# Altium schematic sheet POWER_EXT_DISCRETE.SchDoc
size 594 x 420 mm; SheetNumber: 15; SheetTotal: 25
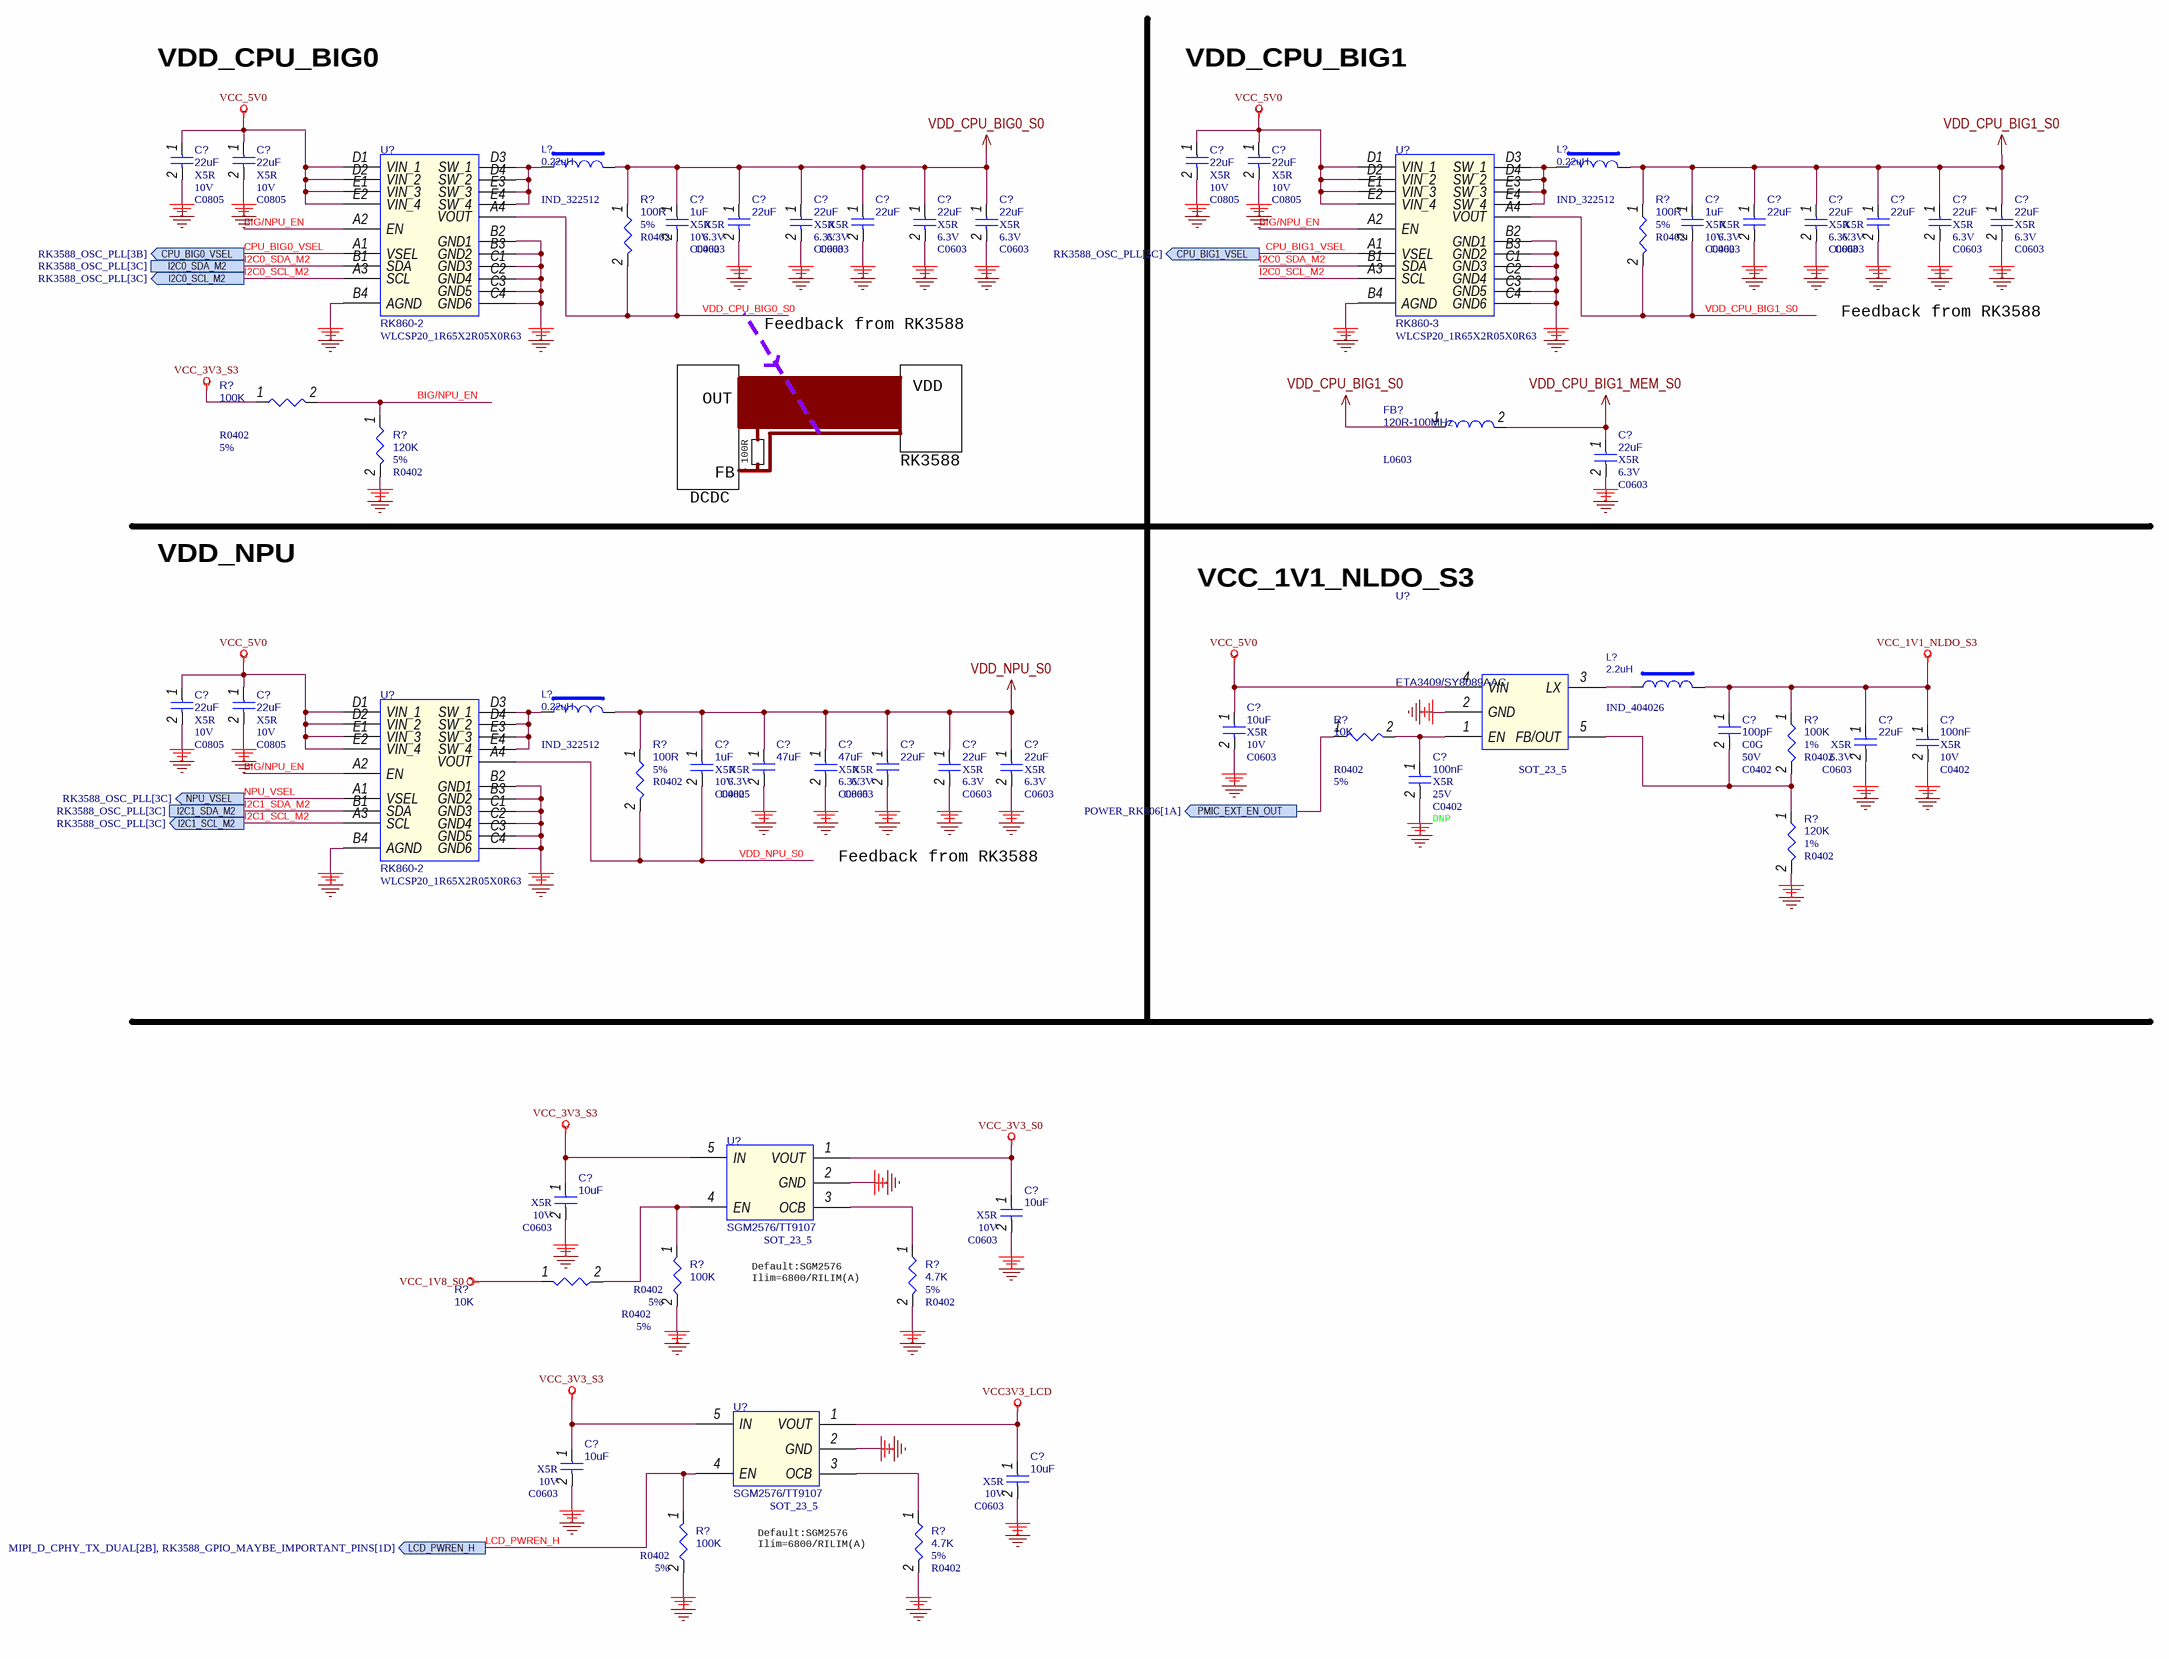
[diagram p0: POWER_EXT_DISCRETE.SchDoc]

## Parts
(Parts that share a designator on the sheet are numbered #1, #2 ... from top to bottom, then left to right.)
C?#1  22uF  Dielectric: X5R  Voltage: 10V  [C0805]
C?#2  22uF  Dielectric: X5R  Voltage: 10V  [C0805]
C?#3  22uF  Dielectric: X5R  Voltage: 10V  [C0805]
C?#4  22uF  Dielectric: X5R  Voltage: 10V  [C0805]
C?#5  1uF  Dielectric: X5R  Voltage: 10V  [C0402]
C?#6  22uF  Dielectric: X5R  Voltage: 6.3V  [C0603]
C?#7  22uF  Dielectric: X5R  Voltage: 6.3V  [C0603]
C?#8  22uF  Dielectric: X5R  Voltage: 6.3V  [C0603]
C?#9  22uF  Dielectric: X5R  Voltage: 6.3V  [C0603]
C?#10  22uF  Dielectric: X5R  Voltage: 6.3V  [C0603]
C?#11  1uF  Dielectric: X5R  Voltage: 10V  [C0402]
C?#12  22uF  Dielectric: X5R  Voltage: 6.3V  [C0603]
C?#13  22uF  Dielectric: X5R  Voltage: 6.3V  [C0603]
C?#14  22uF  Dielectric: X5R  Voltage: 6.3V  [C0603]
C?#15  22uF  Dielectric: X5R  Voltage: 6.3V  [C0603]
C?#16  22uF  Dielectric: X5R  Voltage: 6.3V  [C0603]
C?#17  22uF  Dielectric: X5R  Voltage: 6.3V  [C0603]
C?#18  22uF  Dielectric: X5R  Voltage: 10V  [C0805]
C?#19  22uF  Dielectric: X5R  Voltage: 10V  [C0805]
C?#20  10uF  Dielectric: X5R  Voltage: 10V  [C0603]
C?#21  100pF  Dielectric: C0G  Voltage: 50V  [C0402]
C?#22  22uF  Dielectric: X5R  Voltage: 6.3V  [C0603]
C?#23  100nF  Dielectric: X5R  Voltage: 10V  [C0402]
C?#24  1uF  Dielectric: X5R  Voltage: 10V  [C0402]
C?#25  47uF  Dielectric: X5R  Voltage: 6.3V  [C0805]
C?#26  47uF  Dielectric: X5R  Voltage: 6.3V  [C0805]
C?#27  22uF  Dielectric: X5R  Voltage: 6.3V  [C0603]
C?#28  22uF  Dielectric: X5R  Voltage: 6.3V  [C0603]
C?#29  22uF  Dielectric: X5R  Voltage: 6.3V  [C0603]
C?#30  100nF  Dielectric: X5R  Voltage: 25V  Option: DNP  [C0402]
C?#31  10uF  Dielectric: X5R  Voltage: 10V  [C0603]
C?#32  10uF  Dielectric: X5R  Voltage: 10V  [C0603]
C?#33  10uF  Dielectric: X5R  Voltage: 10V  [C0603]
C?#34  10uF  Dielectric: X5R  Voltage: 10V  [C0603]
FB?  120R-100MHz  [L0603]
L?#1  0.22uH  [IND_322512]
L?#2  0.22uH  [IND_322512]
L?#3  2.2uH  [IND_404026]
L?#4  0.22uH  [IND_322512]
R?#1  100R  Tolerance: 5%  [R0402]
R?#2  100R  Tolerance: 5%  [R0402]
R?#3  100K  Tolerance: 5%  [R0402]
R?#4  120K  Tolerance: 5%  [R0402]
R?#5  100K  Tolerance: 1%  [R0402]
R?#6  10K  Tolerance: 5%  [R0402]
R?#7  100R  Tolerance: 5%  [R0402]
R?#8  120K  Tolerance: 1%  [R0402]
R?#9  100K  Tolerance: 5%  [R0402]
R?#10  4.7K  Tolerance: 5%  [R0402]
R?#11  10K  Tolerance: 5%  [R0402]
R?#12  100K  Tolerance: 5%  [R0402]
R?#13  4.7K  Tolerance: 5%  [R0402]
U?#1  RK860-2  PCB Footprint: WLCSP20_1R65X2R05X0R63  [WLCSP-20]
U?#2  RK860-3  PCB Footprint: WLCSP20_1R65X2R05X0R63  [WLCSP-20]
U?#3  RK860-2  PCB Footprint: WLCSP20_1R65X2R05X0R63  [WLCSP-20]
U?#4  ETA3409/SY8089AAC  [SOT_23_5]
U?#5  SGM2576/TT9107  [SOT_23_5]
U?#6  SGM2576/TT9107  [SOT_23_5]

## Ports
CPU_BIG0_VSEL (out, see RK3588_OSC_PLL[3B]), CPU_BIG1_VSEL (out, see RK3588_OSC_PLL[3C]), I2C0_SCL_M2 (out, see RK3588_OSC_PLL[3C]), I2C0_SDA_M2 (see RK3588_OSC_PLL[3C]), I2C1_SCL_M2 (out, see RK3588_OSC_PLL[3C]), I2C1_SDA_M2 (see RK3588_OSC_PLL[3C]), LCD_PWREN_H (out, see MIPI_D_CPHY_TX_DUAL[2B], RK3588_GPIO_MAYBE_IMPORTANT_PINS[1D]), NPU_VSEL (out, see RK3588_OSC_PLL[3C]), PMIC_EXT_EN_OUT (out, see POWER_RK806[1A])

## Nets
GND: C?#1.2 C?#2.2 C?#3.2 C?#4.2 C?#6.2 C?#7.2 C?#8.2 C?#9.2 C?#10.2 C?#12.2 C?#13.2 C?#14.2 C?#15.2 C?#16.2 C?#17.2 C?#18.2 C?#19.2 C?#20.2 C?#22.2 C?#23.2 C?#25.2 C?#26.2 C?#27.2 C?#28.2 C?#29.2 C?#30.2 C?#31.2 C?#32.2 C?#33.2 C?#34.2 R?#4.2 R?#8.2 R?#9.2 R?#10.2 R?#12.2 R?#13.2 U?#1.B2(GND1) U?#1.B3(GND2) U?#1.B4(AGND) U?#1.C1(GND3) U?#1.C2(GND4) U?#1.C3(GND5) U?#1.C4(GND6) U?#2.B2(GND1) U?#2.B3(GND2) U?#2.B4(AGND) U?#2.C1(GND3) U?#2.C2(GND4) U?#2.C3(GND5) U?#2.C4(GND6) U?#3.B2(GND1) U?#3.B3(GND2) U?#3.B4(AGND) U?#3.C1(GND3) U?#3.C2(GND4) U?#3.C3(GND5) U?#3.C4(GND6) U?#4.2(GND) U?#5.2(GND) U?#6.2(GND)
VCC3V3_LCD: C?#34.1 U?#6.1(VOUT)
VCC_1V1_NLDO_S3: C?#21.1 C?#22.1 C?#23.1 L?#3.2 R?#5.1
VCC_1V8_S0: R?#11.1
VCC_3V3_S0: C?#32.1 U?#5.1(VOUT)
VCC_3V3_S3: C?#31.1 C?#33.1 R?#3.1 U?#5.5(IN) U?#6.5(IN)
VCC_5V0: C?#1.1 C?#2.1 C?#3.1 C?#4.1 C?#18.1 C?#19.1 C?#20.1 U?#1.D1(VIN_1) U?#1.D2(VIN_2) U?#1.E1(VIN_3) U?#1.E2(VIN_4) U?#2.D1(VIN_1) U?#2.D2(VIN_2) U?#2.E1(VIN_3) U?#2.E2(VIN_4) U?#3.D1(VIN_1) U?#3.D2(VIN_2) U?#3.E1(VIN_3) U?#3.E2(VIN_4) U?#4.4(VIN)
VDD_CPU_BIG0_S0: C?#5.1 C?#5.2 C?#6.1 C?#7.1 C?#8.1 C?#9.1 C?#10.1 L?#1.2 R?#1.1 R?#1.2 U?#1.A4(VOUT)
VDD_CPU_BIG1_MEM_S0: C?#17.1 FB?.2
VDD_CPU_BIG1_S0: C?#11.1 C?#11.2 C?#12.1 C?#13.1 C?#14.1 C?#15.1 C?#16.1 FB?.1 L?#2.2 R?#2.1 R?#2.2 U?#2.A4(VOUT)
VDD_NPU_S0: C?#24.1 C?#24.2 C?#25.1 C?#26.1 C?#27.1 C?#28.1 C?#29.1 L?#4.2 R?#7.1 R?#7.2 U?#3.A4(VOUT)
BIG/NPU_EN: R?#3.2 R?#4.1 U?#1.A2(EN) U?#2.A2(EN) U?#3.A2(EN)
CPU_BIG0_VSEL: U?#1.A1(VSEL) ; port CPU_BIG0_VSEL
CPU_BIG1_VSEL: U?#2.A1(VSEL) ; port CPU_BIG1_VSEL
I2C0_SCL_M2: U?#1.A3(SCL) U?#2.A3(SCL) ; port I2C0_SCL_M2
I2C0_SDA_M2: U?#1.B1(SDA) U?#2.B1(SDA) ; port I2C0_SDA_M2
I2C1_SCL_M2: U?#3.A3(SCL) ; port I2C1_SCL_M2
I2C1_SDA_M2: U?#3.B1(SDA) ; port I2C1_SDA_M2
LCD_PWREN_H: R?#12.1 U?#6.4(EN) ; port LCD_PWREN_H
NPU_VSEL: U?#3.A1(VSEL) ; port NPU_VSEL
PMIC_EXT_EN_OUT: R?#6.1 ; port PMIC_EXT_EN_OUT
NetC?#21_2: C?#21.2 R?#5.2 R?#8.1 U?#4.5(FB/OUT)
NetC?#30_1: C?#30.1 R?#6.2 U?#4.1(EN)
NetL?#1_1: L?#1.1 U?#1.D3(SW_1) U?#1.D4(SW_2) U?#1.E3(SW_3) U?#1.E4(SW_4)
NetL?#2_1: L?#2.1 U?#2.D3(SW_1) U?#2.D4(SW_2) U?#2.E3(SW_3) U?#2.E4(SW_4)
NetL?#3_1: L?#3.1 U?#4.3(LX)
NetL?#4_1: L?#4.1 U?#3.D3(SW_1) U?#3.D4(SW_2) U?#3.E3(SW_3) U?#3.E4(SW_4)
NetR?#9_1: R?#9.1 R?#11.2 U?#5.4(EN)
NetR?#10_1: R?#10.1 U?#5.3(OCB)
NetR?#13_1: R?#13.1 U?#6.3(OCB)

## Notes on the sheet
- VDD_CPU_BIG0
- VDD_CPU_BIG1
- Feedback from RK3588
- OUT
- VDD
- FB
- 100R
- RK3588
- DCDC
- VDD_NPU
- VCC_1V1_NLDO_S3
- Default:SGM2576
  Ilim=6800/RILIM(A)
- 420x594
- Формат А2

## Library data of the parts
C?#1 = CAP NP_Dup1: cap,22.00uF,+/-10%,10V,X5R,C0805; Part Reference: C2300; Manufacturer PN: C2012X5R1A226K125AB; Manufacturer: TDK; Tolerance: 10%; Priority: A; PCB Footprint: C0805; Value: 22uF; Created by: JJJ; Part Type: C0805; RK PN: C2012X5R1A226K125AB
C?#2 = CAP NP_Dup1: cap,22.00uF,+/-10%,10V,X5R,C0805; Part Reference: C2301; Manufacturer PN: C2012X5R1A226K125AB; Manufacturer: TDK; Tolerance: 10%; Priority: A; PCB Footprint: C0805; Value: 22uF; Created by: JJJ; Part Type: C0805; RK PN: C2012X5R1A226K125AB
C?#3 = CAP NP_Dup1: cap,22.00uF,+/-10%,10V,X5R,C0805; Part Reference: C2302; Manufacturer PN: C2012X5R1A226K125AB; Manufacturer: TDK; Tolerance: 10%; Priority: A; PCB Footprint: C0805; Value: 22uF; Created by: JJJ; Part Type: C0805; RK PN: C2012X5R1A226K125AB
C?#4 = CAP NP_Dup1: cap,22.00uF,+/-10%,10V,X5R,C0805; Part Reference: C2303; Manufacturer PN: C2012X5R1A226K125AB; Manufacturer: TDK; Tolerance: 10%; Priority: A; PCB Footprint: C0805; Value: 22uF; Created by: JJJ; Part Type: C0805; RK PN: C2012X5R1A226K125AB
C?#5 = CAP NP_Dup1: cap,1.00uF,+/-10%,10V,X5R,C0402; Part Reference: C2304; Manufacturer: TDK; RK PN: C1005X5R1A105K050BB; Priority: A; Tolerance: 10%; PCB Footprint: C0402; Value: 1uF; Part Type: C0402; Manufacturer PN: C1005X5R1A105K050BB; Created by: JJJ
C?#6 = CAP NP_Dup1: cap,22.00uF,+/-20%,6.3V,X5R,C0603; Part Reference: C2305; Manufacturer: TDK; RK PN: C1608X5R0J226M080AC; Priority: A; Tolerance: 20%; PCB Footprint: C0603; Value: 22uF; Part Type: C0603; C_Voltage: 6.3V; Manufacturer PN: C1608X5R0J226M080AC; Created by: JJJ
C?#7 = CAP NP_Dup1: cap,22.00uF,+/-20%,6.3V,X5R,C0603; Part Reference: C2306; Manufacturer PN: C1608X5R0J226M080AC; Manufacturer: TDK; Tolerance: 20%; Priority: A; Number: 37; PCB Footprint: C0603; Value: 22uF; Created by: JJJ; C_Voltage: 6.3V; Part Type: C0603; RK PN: C1608X5R0J226M080AC
C?#8 = CAP NP_Dup1: cap,22.00uF,+/-20%,6.3V,X5R,C0603; Part Reference: C2307; Manufacturer PN: C1608X5R0J226M080AC; Manufacturer: TDK; Tolerance: 20%; Priority: A; PCB Footprint: C0603; Value: 22uF; Created by: JJJ; C_Voltage: 6.3V; Part Type: C0603; RK PN: C1608X5R0J226M080AC
C?#9 = CAP NP_Dup1: cap,22.00uF,+/-20%,6.3V,X5R,C0603; Part Reference: C2308; Manufacturer PN: C1608X5R0J226M080AC; Manufacturer: TDK; Tolerance: 20%; Priority: A; PCB Footprint: C0603; Value: 22uF; Created by: JJJ; Part Type: C0603; RK PN: C1608X5R0J226M080AC
C?#10 = CAP NP_Dup1: cap,22.00uF,+/-20%,6.3V,X5R,C0603; Part Reference: C2309; Manufacturer PN: C1608X5R0J226M080AC; Manufacturer: TDK; Tolerance: 20%; Priority: A; PCB Footprint: C0603; Value: 22uF; Created by: JJJ; Part Type: C0603; RK PN: C1608X5R0J226M080AC
C?#11 = CAP NP_Dup1: cap,1.00uF,+/-10%,10V,X5R,C0402; Part Reference: C2310; Manufacturer: TDK; RK PN: C1005X5R1A105K050BB; Priority: A; Tolerance: 10%; PCB Footprint: C0402; Value: 1uF; Part Type: C0402; Manufacturer PN: C1005X5R1A105K050BB; Created by: JJJ
C?#12 = CAP NP_Dup1: cap,22.00uF,+/-20%,6.3V,X5R,C0603; Part Reference: C2311; Manufacturer: TDK; RK PN: C1608X5R0J226M080AC; Priority: A; Tolerance: 20%; PCB Footprint: C0603; Value: 22uF; Part Type: C0603; C_Voltage: 6.3V; Manufacturer PN: C1608X5R0J226M080AC; Created by: JJJ
C?#13 = CAP NP_Dup1: cap,22.00uF,+/-20%,6.3V,X5R,C0603; Part Reference: C2312; Manufacturer PN: C1608X5R0J226M080AC; Manufacturer: TDK; Tolerance: 20%; Priority: A; Number: 37; PCB Footprint: C0603; Value: 22uF; Created by: JJJ; C_Voltage: 6.3V; Part Type: C0603; RK PN: C1608X5R0J226M080AC
C?#14 = CAP NP_Dup1: cap,22.00uF,+/-20%,6.3V,X5R,C0603; Part Reference: C2313; Manufacturer PN: C1608X5R0J226M080AC; Manufacturer: TDK; Tolerance: 20%; Priority: A; PCB Footprint: C0603; Value: 22uF; Created by: JJJ; C_Voltage: 6.3V; Part Type: C0603; RK PN: C1608X5R0J226M080AC
C?#15 = CAP NP_Dup1: cap,22.00uF,+/-20%,6.3V,X5R,C0603; Part Reference: C2314; Manufacturer PN: C1608X5R0J226M080AC; Manufacturer: TDK; Tolerance: 20%; Priority: A; PCB Footprint: C0603; Value: 22uF; Created by: JJJ; Part Type: C0603; RK PN: C1608X5R0J226M080AC
C?#16 = CAP NP_Dup1: cap,22.00uF,+/-20%,6.3V,X5R,C0603; Part Reference: C2315; Manufacturer PN: C1608X5R0J226M080AC; Manufacturer: TDK; Tolerance: 20%; Priority: A; PCB Footprint: C0603; Value: 22uF; Created by: JJJ; Part Type: C0603; RK PN: C1608X5R0J226M080AC
C?#17 = CAP NP_Dup1: cap,22.00uF,+/-20%,6.3V,X5R,C0603; Part Reference: C2316; Manufacturer PN: C1608X5R0J226M080AC; Manufacturer: TDK; Tolerance: 20%; Priority: A; PCB Footprint: C0603; Value: 22uF; Created by: JJJ; Part Type: C0603; RK PN: C1608X5R0J226M080AC
C?#18 = CAP NP_Dup1: cap,22.00uF,+/-10%,10V,X5R,C0805; Part Reference: C2317; Manufacturer PN: C2012X5R1A226K125AB; Manufacturer: TDK; Tolerance: 10%; Priority: A; PCB Footprint: C0805; Value: 22uF; Created by: JJJ; Part Type: C0805; RK PN: C2012X5R1A226K125AB
C?#19 = CAP NP_Dup1: cap,22.00uF,+/-10%,10V,X5R,C0805; Part Reference: C2318; Manufacturer PN: C2012X5R1A226K125AB; Manufacturer: TDK; Tolerance: 10%; Priority: A; PCB Footprint: C0805; Value: 22uF; Created by: JJJ; Part Type: C0805; RK PN: C2012X5R1A226K125AB
C?#20 = CAP NP_Dup1: cap,10.00uF,+/-10%,10V,X5R,C0603; Part Reference: C2319; Manufacturer PN: C1608X5R1A106K080AC; Manufacturer: TDK; Tolerance: 10%; Priority: A; PCB Footprint: C0603; Value: 10uF; Created by: JJJ; Part Type: C0603; RK PN: C1608X5R1A106K080AC
C?#21 = CAP NP_Dup1: cap,100.00pF,+/-10%,50V,C0G,C0402; Part Reference: C2320; Manufacturer PN: C1005C0G1H101K050BA; Manufacturer: TDK; Tolerance: 10%; Priority: A; PCB Footprint: C0402; Value: 100pF; Created by: JJJ; Part Type: C0402; RK PN: C1005C0G1H101K050BA
C?#22 = CAP NP_Dup1: cap,22.00uF,+/-20%,6.3V,X5R,C0603; Part Reference: C2321; Manufacturer: TDK; RK PN: C1608X5R0J226M080AC; Priority: A; Tolerance: 20%; PCB Footprint: C0603; Value: 22uF; Part Type: C0603; C_Voltage: 6.3V; Manufacturer PN: C1608X5R0J226M080AC; Created by: JJJ
C?#23 = CAP NP_Dup1: cap,100.00nF,+/-10%,10V,X5R,C0402; Part Reference: C2322; Manufacturer PN: C1005X5R1A104K050BA; Manufacturer: TDK; C_Voltage: 6.3V; Tolerance: 10%; Priority: A; Number: 37; PCB Footprint: C0402; Value: 100nF; Created by: JJJ; Part Type: C0402; RK PN: C1005X5R1A104K050BA
C?#24 = CAP NP_Dup1: cap,1.00uF,+/-10%,10V,X5R,C0402; Part Reference: C2323; Manufacturer PN: C1005X5R1A105K050BB; Manufacturer: TDK; Tolerance: 10%; Priority: A; PCB Footprint: C0402; Value: 1uF; Created by: JJJ; Part Type: C0402; RK PN: C1005X5R1A105K050BB
C?#25 = CAP NP_Dup1: cap,47.00uF,+/-20%,6.3V,X5R,C0805; Part Reference: C2324; Manufacturer PN: C2012X5R0J476M125AC; Manufacturer: TDK; Tolerance: 20%; Priority: A; PCB Footprint: C0805; Value: 47uF; Created by: JJJ; C_Voltage: 6.3V; Part Type: C0805; RK PN: C2012X5R0J476M125AC
C?#26 = CAP NP_Dup1: cap,47.00uF,+/-20%,6.3V,X5R,C0805; Part Reference: C2325; Manufacturer: TDK; Number: 37; RK PN: C2012X5R0J476M125AC; Priority: A; Tolerance: 20%; PCB Footprint: C0805; Value: 47uF; Part Type: C0805; Manufacturer PN: C2012X5R0J476M125AC; C_Voltage: 6.3V; Created by: JJJ
C?#27 = CAP NP_Dup1: cap,22.00uF,+/-20%,6.3V,X5R,C0603; Part Reference: C2326; Manufacturer: TDK; RK PN: C1608X5R0J226M080AC; Priority: A; Tolerance: 20%; PCB Footprint: C0603; Value: 22uF; Part Type: C0603; C_Voltage: 6.3V; Manufacturer PN: C1608X5R0J226M080AC; Created by: JJJ
C?#28 = CAP NP_Dup1: cap,22.00uF,+/-20%,6.3V,X5R,C0603; Part Reference: C2327; Manufacturer: TDK; RK PN: C1608X5R0J226M080AC; Priority: A; Tolerance: 20%; PCB Footprint: C0603; Value: 22uF; Part Type: C0603; Manufacturer PN: C1608X5R0J226M080AC; Created by: JJJ
C?#29 = CAP NP_Dup1: cap,22.00uF,+/-20%,6.3V,X5R,C0603; Part Reference: C2328; Manufacturer PN: C1608X5R0J226M080AC; Manufacturer: TDK; Tolerance: 20%; Priority: A; PCB Footprint: C0603; Value: 22uF; Created by: JJJ; Part Type: C0603; RK PN: C1608X5R0J226M080AC
C?#30 = CAP NP_Dup1: cap,100.00nF,+/-10%,25V,X5R,C0402; Part Reference: C2329; Manufacturer: TDK; Number: 37; RK PN: C1005X5R1E104K050BC; Priority: A; Tolerance: 10%; C_Voltage: 6.3V; PCB Footprint: C0402; Value: 100nF; Part Type: C0402; Manufacturer PN: C1005X5R1E104K050BC; Created by: JJJ
C?#31 = CAP NP_Dup1: cap,10.00uF,+/-10%,10V,X5R,C0603; Part Reference: C2330; Manufacturer PN: C1608X5R1A106K080AC; Manufacturer: TDK; Tolerance: 10%; C_Voltage: 6.3V; Priority: A; PCB Footprint: C0603; Value: 10uF; Created by: JJJ; Part Type: C0603; RK PN: C1608X5R1A106K080AC
C?#32 = CAP NP_Dup1: cap,10.00uF,+/-10%,10V,X5R,C0603; Part Reference: C2332; Manufacturer PN: C1608X5R1A106K080AC; Manufacturer: TDK; Tolerance: 10%; C_Voltage: 6.3V; Priority: A; PCB Footprint: C0603; Value: 10uF; Created by: JJJ; Part Type: C0603; RK PN: C1608X5R1A106K080AC
C?#33 = CAP NP_Dup1: cap,10.00uF,+/-10%,10V,X5R,C0603; Part Reference: C2333; Manufacturer PN: C1608X5R1A106K080AC; Manufacturer: TDK; Tolerance: 10%; C_Voltage: 6.3V; Priority: A; PCB Footprint: C0603; Value: 10uF; Created by: JJJ; Part Type: C0603; RK PN: C1608X5R1A106K080AC
C?#34 = CAP NP_Dup1: cap,10.00uF,+/-10%,10V,X5R,C0603; Part Reference: C2335; Manufacturer PN: C1608X5R1A106K080AC; Manufacturer: TDK; Tolerance: 10%; C_Voltage: 6.3V; Priority: A; PCB Footprint: C0603; Value: 10uF; Created by: JJJ; Part Type: C0603; RK PN: C1608X5R1A106K080AC
FB? = BEAD: BEAD,120R@100MHz,current=2000mA,0603; Part Reference: FB2300; Manufacturer PN: BLM18KG121TN1; Manufacturer: Murata; Irms: 2A; Tolerance: 25%; DC Resistor: 0.030ohm; Priority: L; PCB Footprint: L0603; Value: 120R-100MHz; Created by: DZS; Part Type: BEAD; RK PN: BLM18KG121TN1
L?#1 = INDUCTORS OF FERRITE: Power Inductor,0.22uH,20%,IND_322512; Part Reference: L2300; Manufacturer: TDK; DC Resistor: 6ohm; Isat: 10A; RK PN: TMS322512ALM-R22MTAA; Priority: A; Tolerance: 0.2; Resonace frequency: 1MHz; PCB Footprint: IND_322512; Value: 0.22uH; Part Type: POWER_IND; Manufacturer PN: TMS322512ALM-R22MTAA; Created by: YWQ
L?#2 = INDUCTORS OF FERRITE: Power Inductor,0.22uH,20%,IND_322512; Part Reference: L2301; Manufacturer: TDK; DC Resistor: 6ohm; Isat: 10A; RK PN: TMS322512ALM-R22MTAA; Priority: A; Tolerance: 0.2; Resonace frequency: 1MHz; PCB Footprint: IND_322512; Value: 0.22uH; Part Type: POWER_IND; Manufacturer PN: TMS322512ALM-R22MTAA; Created by: YWQ
L?#3 = INDUCTORS OF FERRITE_Dup1: Power Inductor,2.2uH,0.2,IND_404026; Part Reference: L2302; Manufacturer PN: SWPA4026S2R2MT; Manufacturer: sunlord; Isat: 2.10A; DC Resistor: 0.04ohm; Resonace frequency: 96M; Irms: 2A; Tolerance: 20%; Priority: A; PCB Footprint: IND_404026; Value: 2.2uH; Created by: YTL; Part Type: POWER_IND; RK PN: SWPA4026S2R2MT
L?#4 = INDUCTORS OF FERRITE: Power Inductor,0.22uH,20%,IND_322512; Part Reference: L2303; Manufacturer: TDK; DC Resistor: 6ohm; Isat: 10A; RK PN: TMS322512ALM-R22MTAA; Priority: A; Tolerance: 0.2; Resonace frequency: 1MHz; PCB Footprint: IND_322512; Value: 0.22uH; Part Type: POWER_IND; Manufacturer PN: TMS322512ALM-R22MTAA; Created by: YWQ
R?#1 = RESISTOR_Dup2: НЁУГєсД¤µзЧи,100R,+/-5%,R0402,1/16W.; Part Reference: R2300; Manufacturer PN: RC0402JR-07100RL; Manufacturer: YAGEO; Wattage: 1/16W; Priority: A; PCB Footprint: R0402; Value: 100R; Created by: YTL; Part Type: НЁУГєсД¤µзЧи; RK PN: RC0402JR-07100RL
R?#2 = RESISTOR_Dup2: НЁУГєсД¤µзЧи,100R,+/-5%,R0402,1/16W.; Part Reference: R2301; Manufacturer PN: RC0402JR-07100RL; Manufacturer: YAGEO; Wattage: 1/16W; Priority: A; PCB Footprint: R0402; Value: 100R; Created by: YTL; Part Type: НЁУГєсД¤µзЧи; RK PN: RC0402JR-07100RL
R?#3 = RESISTOR_Dup2: НЁУГєсД¤µзЧи,100K,+/-5%,R0402,1/16W.; Part Reference: R2302; Manufacturer PN: RC0402JR-07100KL; Manufacturer: YAGEO; Wattage: 1/16W; Priority: A; PCB Footprint: R0402; Value: 100K; Created by: YTL; Part Type: НЁУГєсД¤µзЧи; RK PN: RC0402JR-07100KL
R?#4 = RESISTOR_Dup2: НЁУГєсД¤µзЧи,120K,+/-5%,R0402,1/16W.; Part Reference: R2303; Manufacturer PN: RC0402JR-07120KL; Manufacturer: YAGEO; Wattage: 1/16W; Priority: A; PCB Footprint: R0402; Value: 120K; Created by: YTL; Part Type: НЁУГєсД¤µзЧи; RK PN: RC0402JR-07120KL
R?#5 = RESISTOR_Dup2: НЁУГєсД¤µзЧи,100K,+/-1%,R0402,1/16W.; Part Reference: R2305; Manufacturer PN: RC0402FR-07100KL; Manufacturer: YAGEO; Wattage: 1/16W; Priority: A; PCB Footprint: R0402; Value: 100K; Created by: YTL; Part Type: НЁУГєсД¤µзЧи; RK PN: RC0402FR-07100KL
R?#6 = RESISTOR_Dup2: НЁУГєсД¤µзЧи,10K,+/-5%,R0402,1/16W.; Part Reference: R2304; Manufacturer PN: RC0402JR-0710KL; Manufacturer: YAGEO; Wattage: 1/16W; Priority: A; PCB Footprint: R0402; Value: 10K; Created by: YTL; Part Type: НЁУГєсД¤µзЧи; RK PN: RC0402JR-0710KL
R?#7 = RESISTOR_Dup2: НЁУГєсД¤µзЧи,100R,+/-5%,R0402,1/16W.; Part Reference: R2306; Manufacturer PN: RC0402JR-07100RL; Manufacturer: YAGEO; Wattage: 1/16W; Priority: A; PCB Footprint: R0402; Value: 100R; Created by: YTL; Part Type: НЁУГєсД¤µзЧи; RK PN: RC0402JR-07100RL
R?#8 = RESISTOR_Dup2: НЁУГєсД¤µзЧи,120K,+/-1%,R0402,1/16W.; Part Reference: R2307; Manufacturer PN: RC0402FR-07120KL; Manufacturer: YAGEO; Wattage: 1/16W; Priority: A; PCB Footprint: R0402; Value: 120K; Created by: YTL; Part Type: НЁУГєсД¤µзЧи; RK PN: RC0402FR-07120KL
R?#9 = RESISTOR_Dup2: НЁУГєсД¤µзЧи,100K,+/-5%,R0402,1/16W.; Part Reference: R2350; Manufacturer: YAGEO; RK PN: RC0402JR-07100KL; Priority: A; Wattage: 1/16W; PCB Footprint: R0402; Value: 100K; Part Type: НЁУГєсД¤µзЧи; Manufacturer PN: RC0402JR-07100KL; Created by: YTL
R?#10 = RESISTOR_Dup2: НЁУГєсД¤µзЧи,4K7,+/-5%,R0402,1/16W.; Part Reference: R2322; Manufacturer PN: RC0402JR-074K7L; Manufacturer: YAGEO; Wattage: 1/16W; Priority: A; PCB Footprint: R0402; Value: 4.7K; Created by: YTL; Part Type: НЁУГєсД¤µзЧи; RK PN: RC0402JR-074K7L
R?#11 = RESISTOR_Dup2: НЁУГєсД¤µзЧи,10K,+/-5%,R0402,1/16W.; Part Reference: R2311; Manufacturer: YAGEO; RK PN: RC0402JR-0710KL; Priority: A; Wattage: 1/16W; PCB Footprint: R0402; Value: 10K; Part Type: НЁУГєсД¤µзЧи; Manufacturer PN: RC0402JR-0710KL; Created by: YTL
R?#12 = RESISTOR_Dup2: НЁУГєсД¤µзЧи,100K,+/-5%,R0402,1/16W.; Part Reference: R2324; Manufacturer: YAGEO; RK PN: RC0402JR-07100KL; Priority: A; Wattage: 1/16W; PCB Footprint: R0402; Value: 100K; Part Type: НЁУГєсД¤µзЧи; Manufacturer PN: RC0402JR-07100KL; Created by: YTL
R?#13 = RESISTOR_Dup2: НЁУГєсД¤µзЧи,4K7,+/-5%,R0402,1/16W.; Part Reference: R2323; Manufacturer PN: RC0402JR-074K7L; Manufacturer: YAGEO; Wattage: 1/16W; Priority: A; PCB Footprint: R0402; Value: 4.7K; Created by: YTL; Part Type: НЁУГєсД¤µзЧи; RK PN: RC0402JR-074K7L
U?#1 = DCDC_RK860: I2C-ADDR 42HЈ»Vout 0.5-1.5VЈ»Default Vout 0.8VЈ»Step 6.25mVЈ»Die_ID 0XA;; Part Reference: U2300; Manufacturer: Rockchip (ИрРѕОў); Priority: A; Value: RK860-2; Created by: YWQ; Manufacturer PN: RK860-2; Part Type: DCDC; RK PN: RK860-2
U?#2 = DCDC_RK860: I2C-ADDR 43HЈ»Vout 0.5-1.5VЈ»Default Vout 0.8VЈ»Step 6.25mVЈ»Die_ID 0XA;; Part Reference: U2301; Manufacturer: Rockchip (ИрРѕОў); Priority: A; Value: RK860-3; Created by: YWQ; Manufacturer PN: RK860-3; Part Type: DCDC; RK PN: RK860-3
U?#3 = DCDC_RK860: I2C-ADDR 42HЈ»Vout 0.5-1.5VЈ»Default Vout 0.8VЈ»Step 6.25mVЈ»Die_ID 0XA;; Part Reference: U2303; Manufacturer: Rockchip (ИрРѕОў); Priority: A; Value: RK860-2; Created by: YWQ; Manufacturer PN: RK860-2; Part Type: DCDC; RK PN: RK860-2
U?#4 = DCDC_SY8088: High Efficiency 5.5V, 2A continuous, 3A peak, 1MHz Synchronous Step Down Regulator; Part Reference: U2302; Manufacturer: SilergyЈЁОщБ¦ЅЬЈ©; Priority: A; PCB Footprint: SOT_23_5; Value: ETA3409/SY8089AAC; Created by: JJJ; Manufacturer PN: SY8089AAC; Part Type: DCDC; RK PN: SY8089AAC
U?#5 = SWITCH_SY6280: 1A Current Limited Load Switch; Part Reference: U2305; Manufacturer PN: TT9107; Manufacturer: Torch-chipЈЁМАіПµзЧУЈ©; Priority: A; PCB Footprint: SOT_23_5; Value: SGM2576/TT9107; Created by: JJJ; Part Type: Switch; RK PN: TT9107
U?#6 = SWITCH_SY6280: 1A Current Limited Load Switch; Part Reference: U2306; Manufacturer PN: TT9107; Manufacturer: Torch-chipЈЁМАіПµзЧУЈ©; Priority: A; PCB Footprint: SOT_23_5; Value: SGM2576/TT9107; Created by: JJJ; Part Type: Switch; RK PN: TT9107